# EAGLE schematic trailmon (EAGLE 7.5.0)

## Sheet 1 of 7
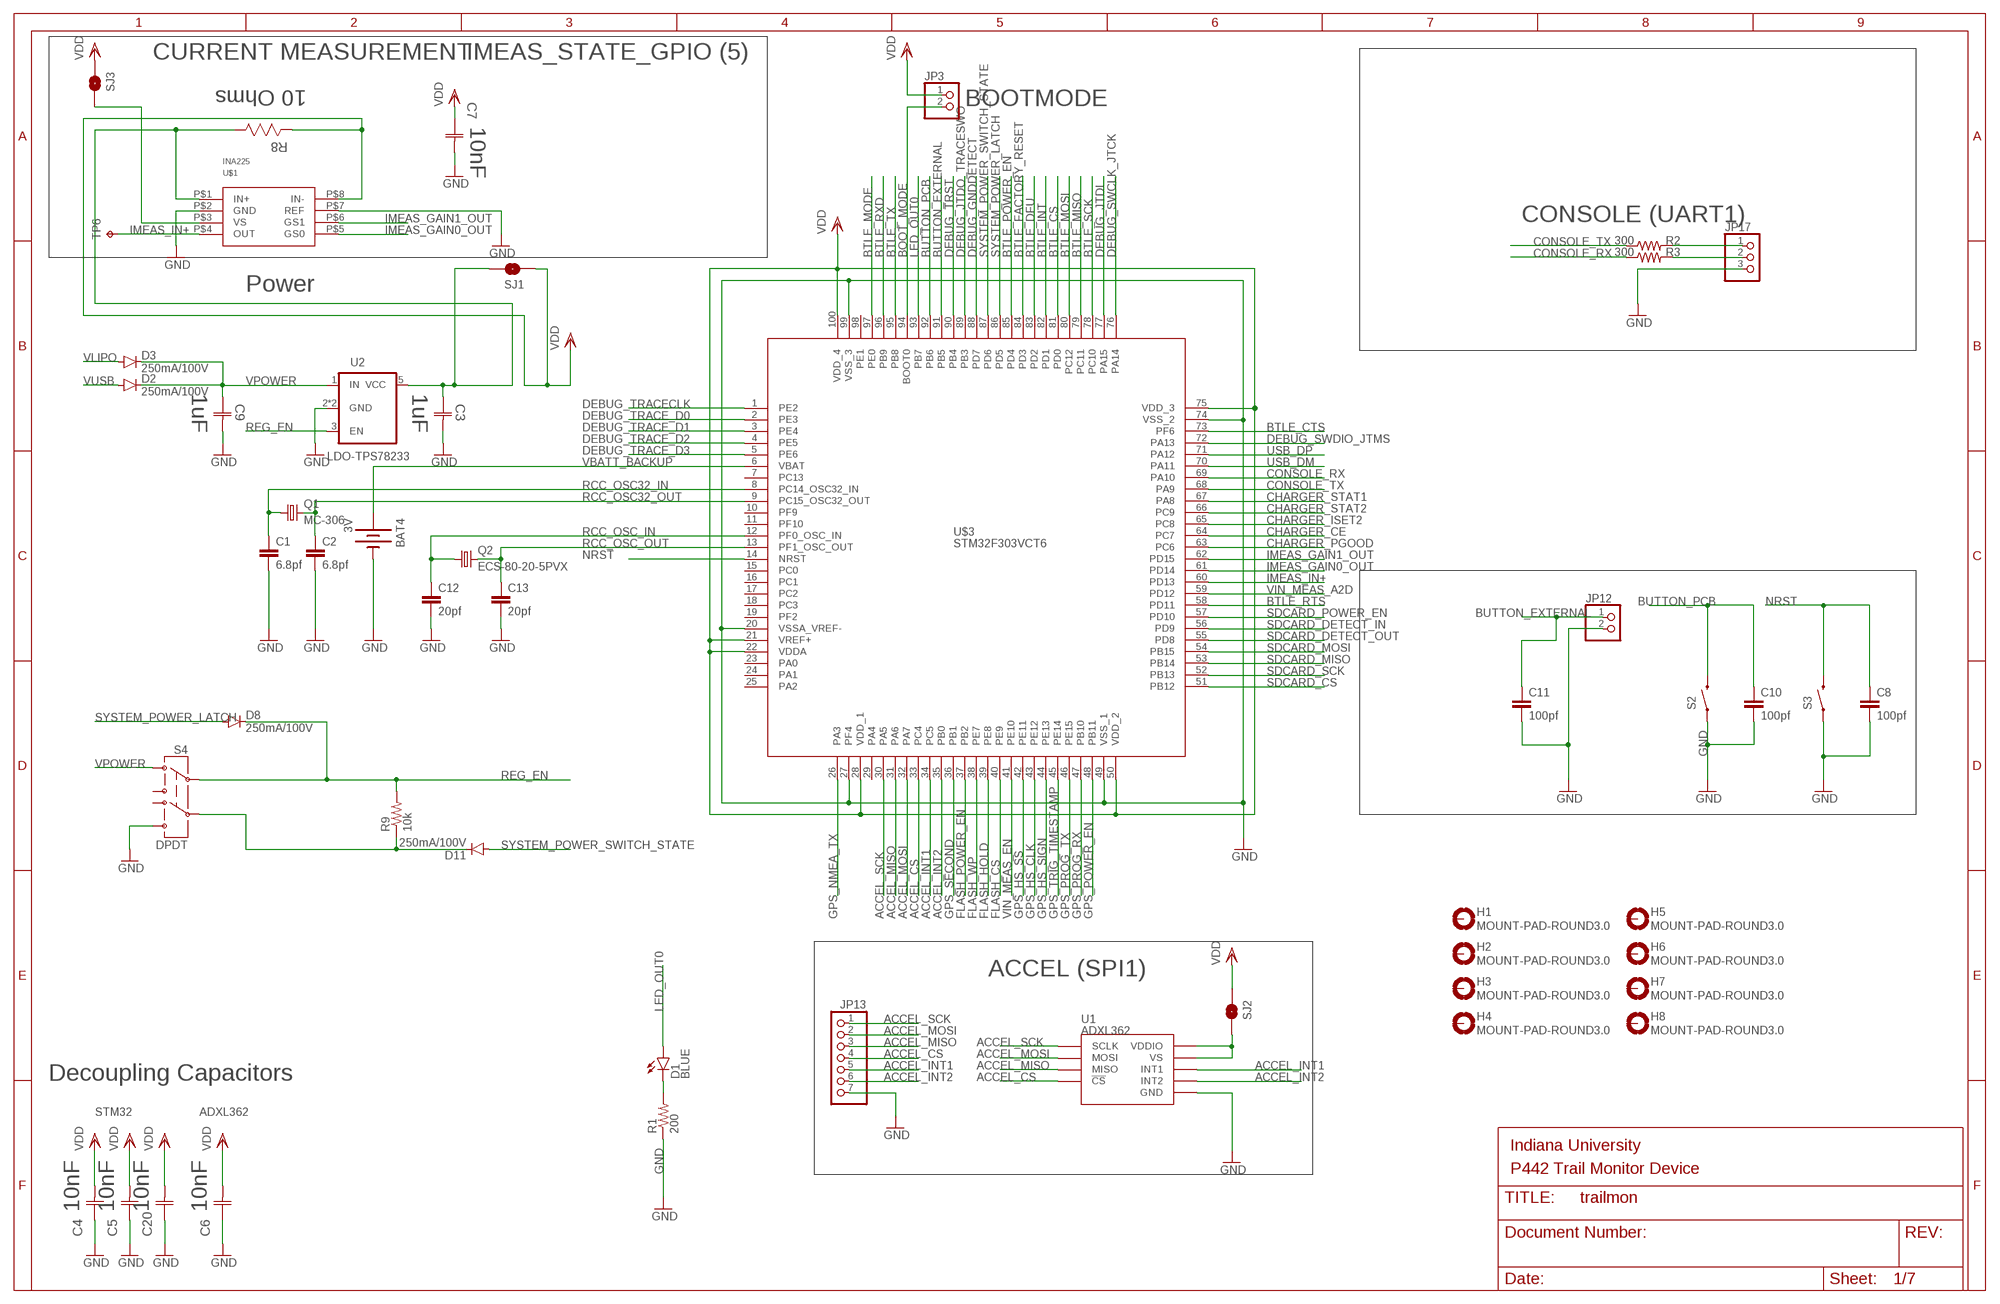
[diagram p0: schematic, sheet 1]

### Parts
BAT4  3V  BATTERY12MM  [BATTCON_12MM]
C1  6.8pf  CAP0603-CAP  [0603-CAP]
C2  6.8pf  CAP0603-CAP  [0603-CAP]
C3  1uF  C0805C105K4RACTU  [CAPC2013X110N]
C4  10nF  C0805C103K5RACTU  [CAPC2013X88N]
C5  10nF  C0805C103K5RACTU  [CAPC2013X88N]
C6  10nF  C0805C103K5RACTU  [CAPC2013X88N]
C7  10nF  C0805C103K5RACTU  [CAPC2013X88N]
C8  100pf  CAP0805  [0805]
C9  1uF  C0805C105K4RACTU  [CAPC2013X110N]
C10  100pf  CAP0805  [0805]
C11  100pf  CAP0805  [0805]
C12  20pf  CAP0603-CAP  [0603-CAP]
C13  20pf  CAP0603-CAP  [0603-CAP]
C20  10nF  C0805C103K5RACTU  [CAPC2013X88N]
D1  BLUE  LED-BLUE0603  [LED-0603]
D2  250mA/100V  DIODEBAS16  [SOD-323]
D3  250mA/100V  DIODEBAS16  [SOD-323]
D8  250mA/100V  DIODEBAS16  [SOD-323]
D11  250mA/100V  DIODEBAS16  [SOD-323]
H1  MOUNT-PAD-ROUND3.0  [3,0-PAD]
H2  MOUNT-PAD-ROUND3.0  [3,0-PAD]
H3  MOUNT-PAD-ROUND3.0  [3,0-PAD]
H4  MOUNT-PAD-ROUND3.0  [3,0-PAD]
H5  MOUNT-PAD-ROUND3.0  [3,0-PAD]
H6  MOUNT-PAD-ROUND3.0  [3,0-PAD]
H7  MOUNT-PAD-ROUND3.0  [3,0-PAD]
H8  MOUNT-PAD-ROUND3.0  [3,0-PAD]
JP3  PINHD-1X2  [1X02]
JP12  PINHD-1X2  [1X02]
JP13  PINHD-1X7  [1X07]
JP17  PINHD-1X3  [1X03]
Q1  MC-306  [MC-306]
Q2  ECS-80-20-5PVX  CSM-7X-DU  [CSM-7X-DU]
R1  200  RESISTOR0603-RES  [0603-RES]
R2  300  RESISTOR0805-RES  [0805]
R3  300  RESISTOR0805-RES  [0805]
R8  10 Ohms  TNPW060310R0BEEN  [RESC1608X60N]
R9  10k  RESISTOR0603-RES  [0603-RES]
S2  SWITCH-MOMENTARY-2SMD  [TACTILE-SWITCH-SMD]
S3  SWITCH-MOMENTARY-2SMD  [TACTILE-SWITCH-SMD]
S4  DPDT  SWITCH-DPDTAYZ0202  [AYZ0202]
SJ1  JUMPER-PAD-2-NOYES_SILK  [PAD-JUMPER-2-NO_YES_SILK]
SJ2  JUMPER-PAD-2-NOYES_SILK  [PAD-JUMPER-2-NO_YES_SILK]
SJ3  JUMPER-PAD-2-NOYES_SILK  [PAD-JUMPER-2-NO_YES_SILK]
TP6  TPB1,27  [B1,27]
U1  ADXL362  [ADXL362]
U2  LDO-TPS78233  [SOT23-5]
U$1  INA225  [MSOP-8]
U$3  STM32F303VCT6  [TQFP100]

### Nets
ACCEL_CS: JP13.4 U1.P$8(!CS) U$3.33(PC4)
ACCEL_INT1: JP13.5 U1.P$11(INT1) U$3.34(PC5)
ACCEL_INT2: JP13.6 U1.P$9(INT2) U$3.35(PB0)
ACCEL_MISO: JP13.3 U1.P$7(MISO) U$3.31(PA6)
ACCEL_MOSI: JP13.2 U1.P$6(MOSI) U$3.32(PA7)
ACCEL_SCK: JP13.1 U1.P$4(SCLK) U$3.30(PA5)
BOOT_MODE: JP3.2 U$3.94(BOOT0)
BTLE_CS: U$3.81(PD0) ; also sheet 7
BTLE_CTS: U$3.73(PF6) ; also sheet 7
BTLE_DFU: U$3.83(PD2) ; also sheet 7
BTLE_FACTORY_RESET: U$3.84(PD3) ; also sheet 7
BTLE_INT: U$3.82(PD1) ; also sheet 7
BTLE_MISO: U$3.79(PC11) ; also sheet 7
BTLE_MODE: U$3.97(PE0) ; also sheet 7
BTLE_MOSI: U$3.80(PC12) ; also sheet 7
BTLE_POWER_EN: U$3.85(PD4) ; also sheet 2
BTLE_RTS: U$3.58(PD11) ; also sheet 7
BTLE_RXD: U$3.96(PB9) ; also sheet 7
BTLE_SCK: U$3.78(PC10) ; also sheet 7
BTLE_TX: U$3.95(PB8) ; also sheet 7
BUTTON_EXTERNAL: C11.1 JP12.1 U$3.91(PB5)
BUTTON_PCB: C10.1 S2.3 U$3.92(PB6)
CHARGER_CE: U$3.64(PC7) ; also sheet 4
CHARGER_ISET2: U$3.65(PC8) ; also sheet 4
CHARGER_PGOOD: U$3.63(PC6) ; also sheet 4
CHARGER_STAT1: U$3.67(PA8) ; also sheet 4
CHARGER_STAT2: U$3.66(PC9) ; also sheet 4
CONSOLE_RX: R3.1 U$3.69(PA10)
CONSOLE_TX: R2.1 U$3.68(PA9)
DEBUG_GNDDETECT: U$3.88(PD7)
DEBUG_JTDI: U$3.77(PA15) ; also sheet 6
DEBUG_JTDO_TRACESWO: U$3.89(PB3) ; also sheet 6
DEBUG_SWCLK_JTCK: U$3.76(PA14) ; also sheet 6
DEBUG_SWDIO_JTMS: U$3.72(PA13) ; also sheet 6
DEBUG_TRACE_D0: U$3.2(PE3) ; also sheet 6
DEBUG_TRACE_D1: U$3.3(PE4) ; also sheet 6
DEBUG_TRACE_D2: U$3.4(PE5) ; also sheet 6
DEBUG_TRACE_D3: U$3.5(PE6) ; also sheet 6
DEBUG_TRACECLK: U$3.1(PE2) ; also sheet 6
DEBUG_TRST: U$3.90(PB4) ; also sheet 6
FLASH_CS: U$3.40(PE9) ; also sheet 5
FLASH_HOLD: U$3.39(PE8) ; also sheet 5
FLASH_POWER_EN: U$3.37(PB2) ; also sheet 2
FLASH_WP: U$3.38(PE7) ; also sheet 5
GND: BAT4.GND(-) C1.2 C2.2 C3.2(C2) C4.1(C1) C5.1(C1) C6.1(C1) C7.2(C2) C8.2 C9.2(C2) C10.2 C11.2 C12.2 C13.2 C20.1(C1) JP12.2 JP13.7 JP17.3 R1.1 S2.1 S3.1 S4.6 U1.P$12(GND) U1.P$13(GND) U1.P$16(GND) U2.2(GND) U2.4(GND) U$1.P$2(GND) U$1.P$7(REF) U$3.20(VSSA_VREF-) U$3.27(PF4) U$3.49(VSS_1) U$3.74(VSS_2) U$3.99(VSS_3) ; also sheet 2,3,4,5,6,7
GPS_HS_CLK: U$3.43(PE12) ; also sheet 3
GPS_HS_SIGN: U$3.44(PE13) ; also sheet 3
GPS_HS_SS: U$3.42(PE11) ; also sheet 3
GPS_NMEA_TX: U$3.26(PA3) ; also sheet 3
GPS_POWER_EN: U$3.48(PB11) ; also sheet 2
GPS_PROG_RX: U$3.47(PB10) ; also sheet 3
GPS_PROG_TX: U$3.46(PE15) ; also sheet 3
GPS_SECOND: U$3.36(PB1) ; also sheet 3
GPS_TRIG_TIMESTAMP: U$3.45(PE14) ; also sheet 3
IMEAS_GAIN0_OUT: U$1.P$5(GS0) U$3.61(PD14)
IMEAS_GAIN1_OUT: U$1.P$6(GS1) U$3.62(PD15)
IMEAS_IN+: TP6.TP U$1.P$4(OUT) U$3.60(PD13)
LED_OUT0: D1.A U$3.93(PB7)
N$4: D1.C R1.2
N$11: D11.C R9.1 S4.5
N$28: JP17.1 R2.2
N$29: JP17.2 R3.2
N$34: SJ2.2 U1.P$1(VDDIO) U1.P$14(VS)
N$35: SJ3.2 U$1.P$3(VS)
NRST: C8.1 S3.3 U$3.14(NRST) ; also sheet 6
RCC_OSC32_IN: C1.1 Q1.1 U$3.8(PC14_OSC32_IN)
RCC_OSC32_OUT: C2.1 Q1.4 U$3.9(PC15_OSC32_OUT)
RCC_OSC_IN: C12.1 Q2.1 U$3.12(PF0_OSC_IN)
RCC_OSC_OUT: C13.1 Q2.2 U$3.13(PF1_OSC_OUT)
REG_EN: D8.C R9.2 S4.2 U2.3(EN)
SDCARD_CS: U$3.51(PB12) ; also sheet 5
SDCARD_DETECT_IN: U$3.56(PD9) ; also sheet 5
SDCARD_DETECT_OUT: U$3.55(PD8) ; also sheet 5
SDCARD_MISO: U$3.53(PB14) ; also sheet 5
SDCARD_MOSI: U$3.54(PB15) ; also sheet 5
SDCARD_POWER_EN: U$3.57(PD10) ; also sheet 2
SDCARD_SCK: U$3.52(PB13) ; also sheet 5
SYSTEM_POWER_LATCH: D8.A U$3.86(PD5)
SYSTEM_POWER_SWITCH_STATE: D11.A U$3.87(PD6)
USB_DM: U$3.70(PA11) ; also sheet 4
USB_DP: U$3.71(PA12) ; also sheet 4
VBATT_BACKUP: BAT4.PWR@1(+) U$3.6(VBAT)
VCC: C3.1(C1) R8.1 SJ1.2 U2.5(VCC) U$1.P$1(IN+)
VDD: C4.2(C2) C5.2(C2) C6.2(C2) C7.1(C1) C20.2(C2) JP3.1 R8.2 SJ1.1 SJ2.1 SJ3.1 U$1.P$8(IN-) U$3.21(VREF+) U$3.22(VDDA) U$3.28(VDD_1) U$3.50(VDD_2) U$3.75(VDD_3) U$3.100(VDD_4) ; also sheet 2,4,6
VIN_MEAS_A2D: U$3.59(PD12) ; also sheet 2
VIN_MEAS_EN: U$3.41(PE10) ; also sheet 2
VLIPO: D3.A ; also sheet 2,4
VPOWER: C9.1(C1) D2.C D3.C S4.1 U2.1(IN)
VUSB: D2.A ; also sheet 4
Unconnected: H1.B3,0(MOUNT) H2.B3,0(MOUNT) H3.B3,0(MOUNT) H4.B3,0(MOUNT) H5.B3,0(MOUNT) H6.B3,0(MOUNT) H7.B3,0(MOUNT) H8.B3,0(MOUNT) S4.3 S4.4 U$3.7(PC13) U$3.10(PF9) U$3.11(PF10) U$3.15(PC0) U$3.16(PC1) U$3.17(PC2) U$3.18(PC3) U$3.19(PF2) U$3.23(PA0) U$3.24(PA1) U$3.25(PA2) U$3.29(PA4) U$3.98(PE1)

### Notes on the sheet
- CURRENT MEASUREMENT | IMEAS_STATE_GPIO (5)
- BOOTMODE
- CONSOLE (UART1)
- Power
- ACCEL (SPI1)
- Decoupling Capacitors
- STM32 | ADXL362
- Indiana University
- P442 Trail Monitor Device

## Sheet 2 of 7
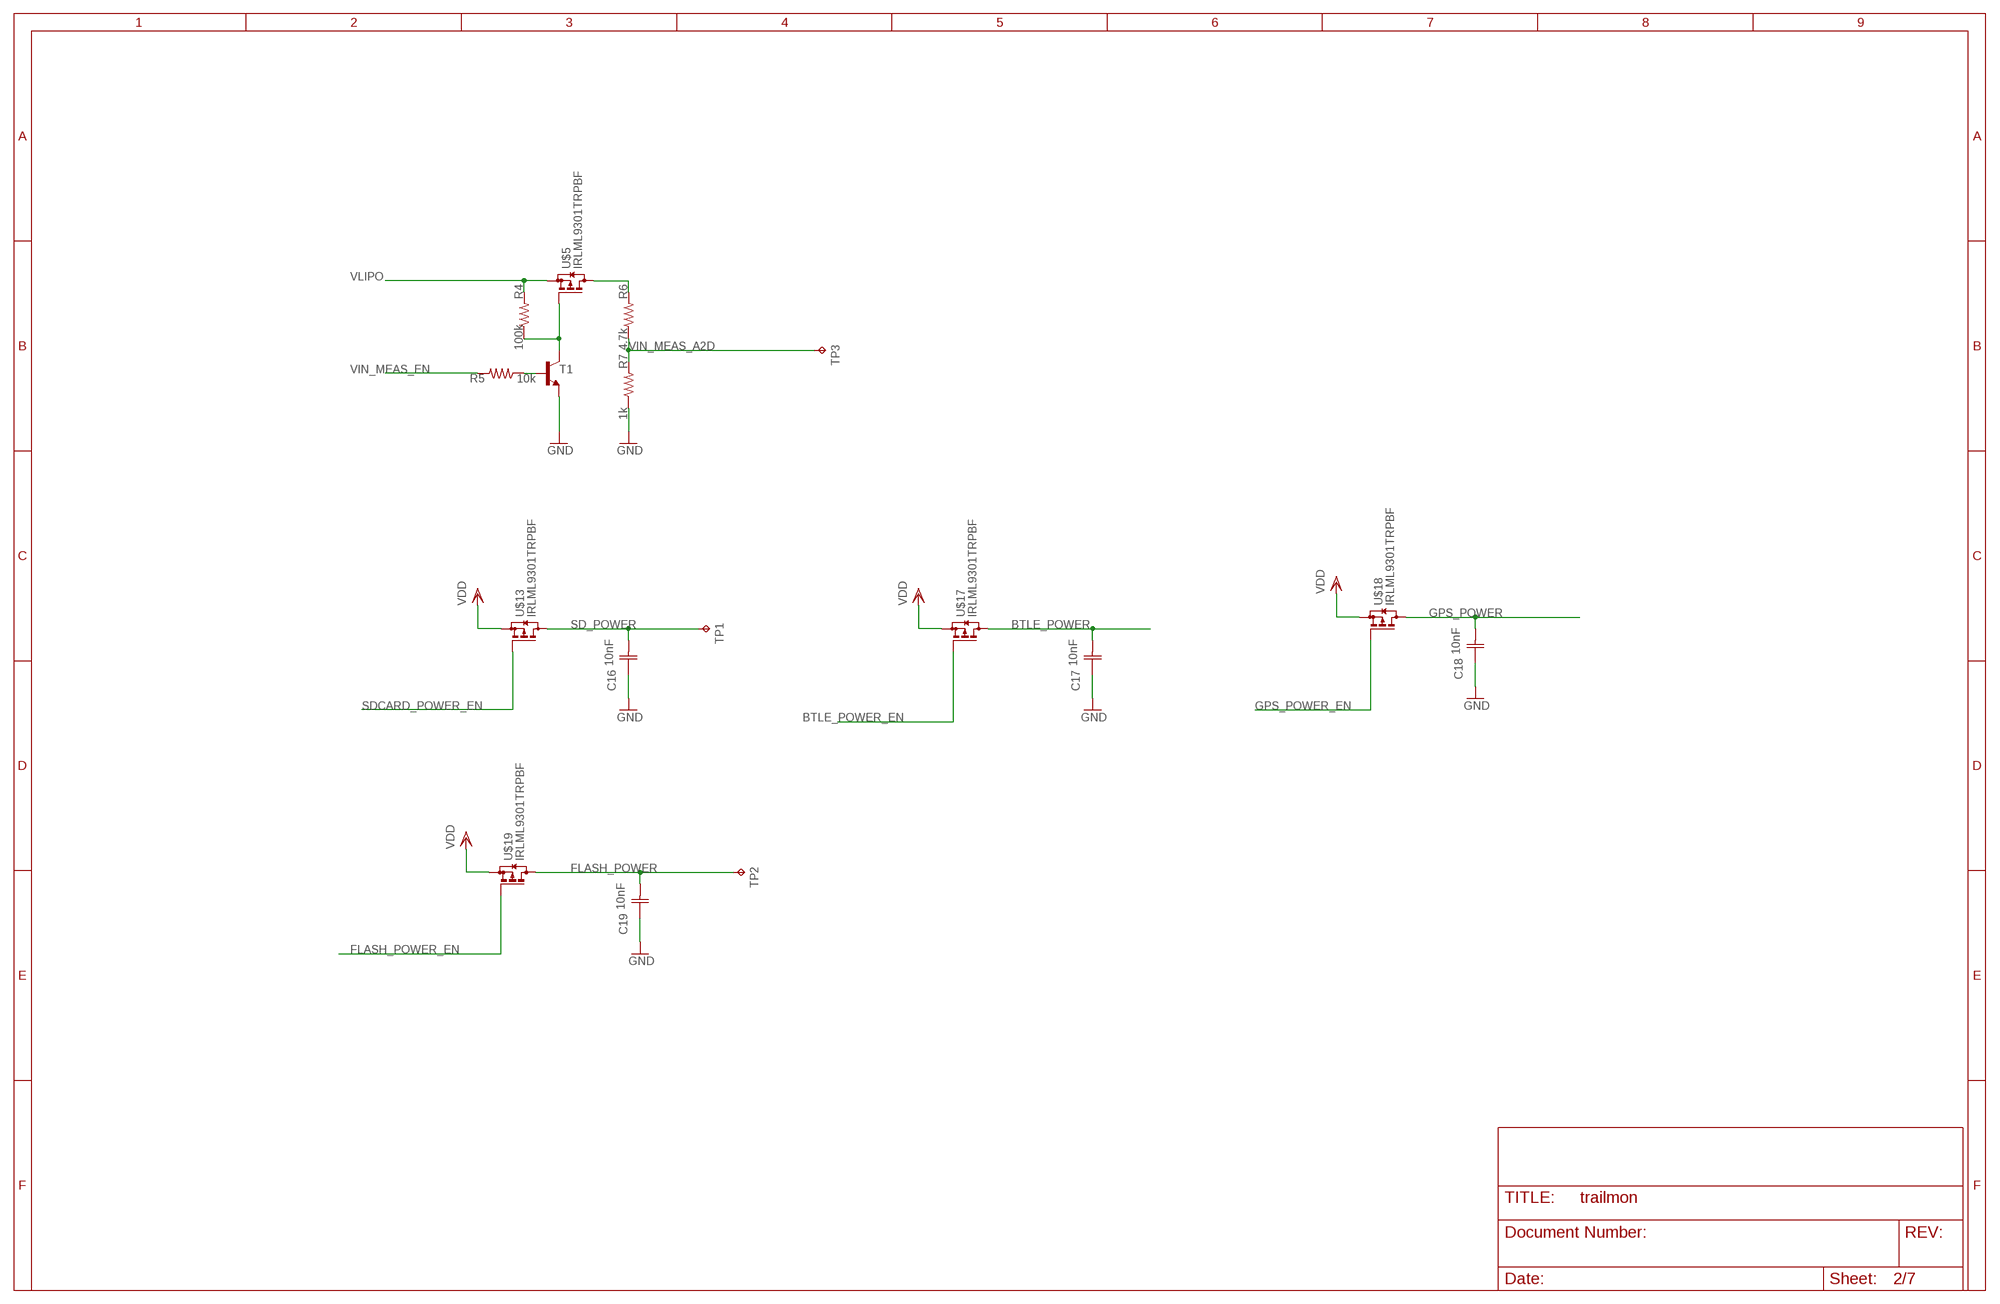
[diagram p1: schematic, sheet 2]

### Parts
C16  10nF  C0805C103K5RACTU  [CAPC2013X88N]
C17  10nF  C0805C103K5RACTU  [CAPC2013X88N]
C18  10nF  C0805C103K5RACTU  [CAPC2013X88N]
C19  10nF  C0805C103K5RACTU  [CAPC2013X88N]
R4  100k  RESISTOR0805-RES  [0805]
R5  10k  RESISTOR0805-RES  [0805]
R6  4.7k  RESISTOR0805-RES  [0805]
R7  1k  RESISTOR0805-RES  [0805]
T1  BC847  [SOT23]
TP1  TPB1,27  [B1,27]
TP2  TPB1,27  [B1,27]
TP3  TPB1,27  [B1,27]
U$5  IRLML9301TRPBF  [SOT23]
U$13  IRLML9301TRPBF  [SOT23]
U$17  IRLML9301TRPBF  [SOT23]
U$18  IRLML9301TRPBF  [SOT23]
U$19  IRLML9301TRPBF  [SOT23]

### Nets
BTLE_POWER: C17.2(C2) U$17.3(D) ; also sheet 7
BTLE_POWER_EN: U$17.1(G) ; also sheet 1
FLASH_POWER: C19.2(C2) TP2.TP U$19.3(D) ; also sheet 5
FLASH_POWER_EN: U$19.1(G) ; also sheet 1
GND: C16.1(C1) C17.1(C1) C18.1(C1) C19.1(C1) R7.1 T1.2(E) ; also sheet 1,3,4,5,6,7
GPS_POWER: C18.2(C2) U$18.3(D) ; also sheet 3
GPS_POWER_EN: U$18.1(G) ; also sheet 1
N$1: R5.1 T1.1(B)
N$5: R4.1 T1.3(C) U$5.1(G)
N$21: R6.2 U$5.3(D)
SD_POWER: C16.2(C2) TP1.TP U$13.3(D) ; also sheet 5
SDCARD_POWER_EN: U$13.1(G) ; also sheet 1
VDD: U$13.2(S) U$17.2(S) U$18.2(S) U$19.2(S) ; also sheet 1,4,6
VIN_MEAS_A2D: R6.1 R7.2 TP3.TP ; also sheet 1
VIN_MEAS_EN: R5.2 ; also sheet 1
VLIPO: R4.2 U$5.2(S) ; also sheet 1,4

## Sheet 3 of 7
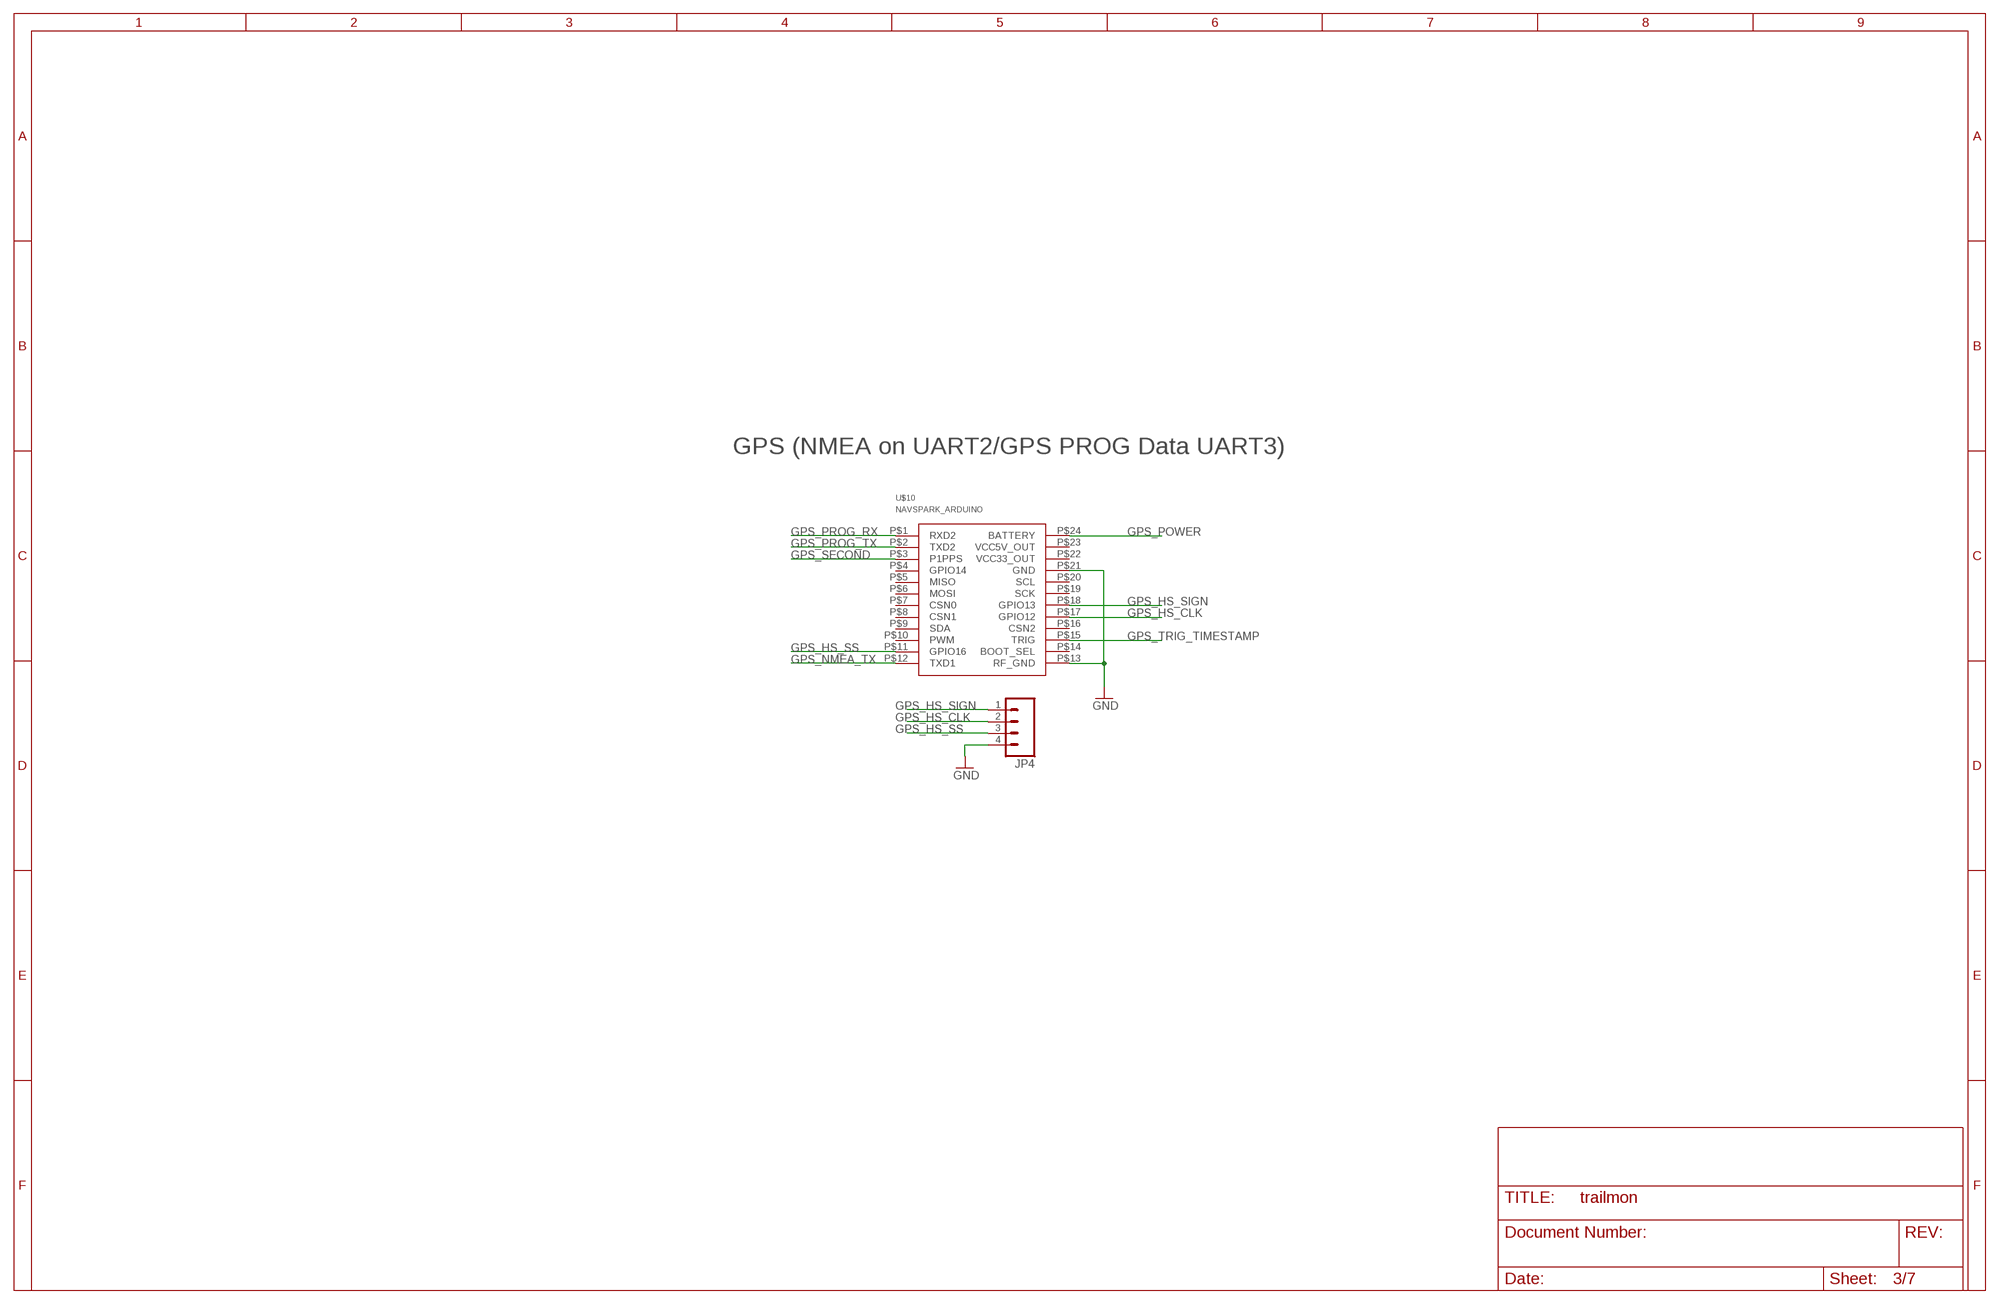
[diagram p2: schematic, sheet 3]

### Parts
JP4  M04PTH  [1X04]
U$10  NAVSPARK_ARDUINO  [NAVSPARK_ARDUINO]

### Nets
GND: JP4.4 U$10.P$13(RF_GND) U$10.P$21(GND) ; also sheet 1,2,4,5,6,7
GPS_HS_CLK: JP4.2 U$10.P$17(GPIO12) ; also sheet 1
GPS_HS_SIGN: JP4.1 U$10.P$18(GPIO13) ; also sheet 1
GPS_HS_SS: JP4.3 U$10.P$11(GPIO16) ; also sheet 1
GPS_NMEA_TX: U$10.P$12(TXD1) ; also sheet 1
GPS_POWER: U$10.P$24(BATTERY) ; also sheet 2
GPS_PROG_RX: U$10.P$1(RXD2) ; also sheet 1
GPS_PROG_TX: U$10.P$2(TXD2) ; also sheet 1
GPS_SECOND: U$10.P$3(P1PPS) ; also sheet 1
GPS_TRIG_TIMESTAMP: U$10.P$15(TRIG) ; also sheet 1
Unconnected: U$10.P$4(GPIO14) U$10.P$5(MISO) U$10.P$6(MOSI) U$10.P$7(CSN0) U$10.P$8(CSN1) U$10.P$9(SDA) U$10.P$10(PWM) U$10.P$14(BOOT_SEL) U$10.P$16(CSN2) U$10.P$19(SCK) U$10.P$20(SCL) U$10.P$22(VCC33_OUT) U$10.P$23(VCC5V_OUT)

### Notes on the sheet
- GPS (NMEA on UART2/GPS PROG Data UART3)

## Sheet 4 of 7
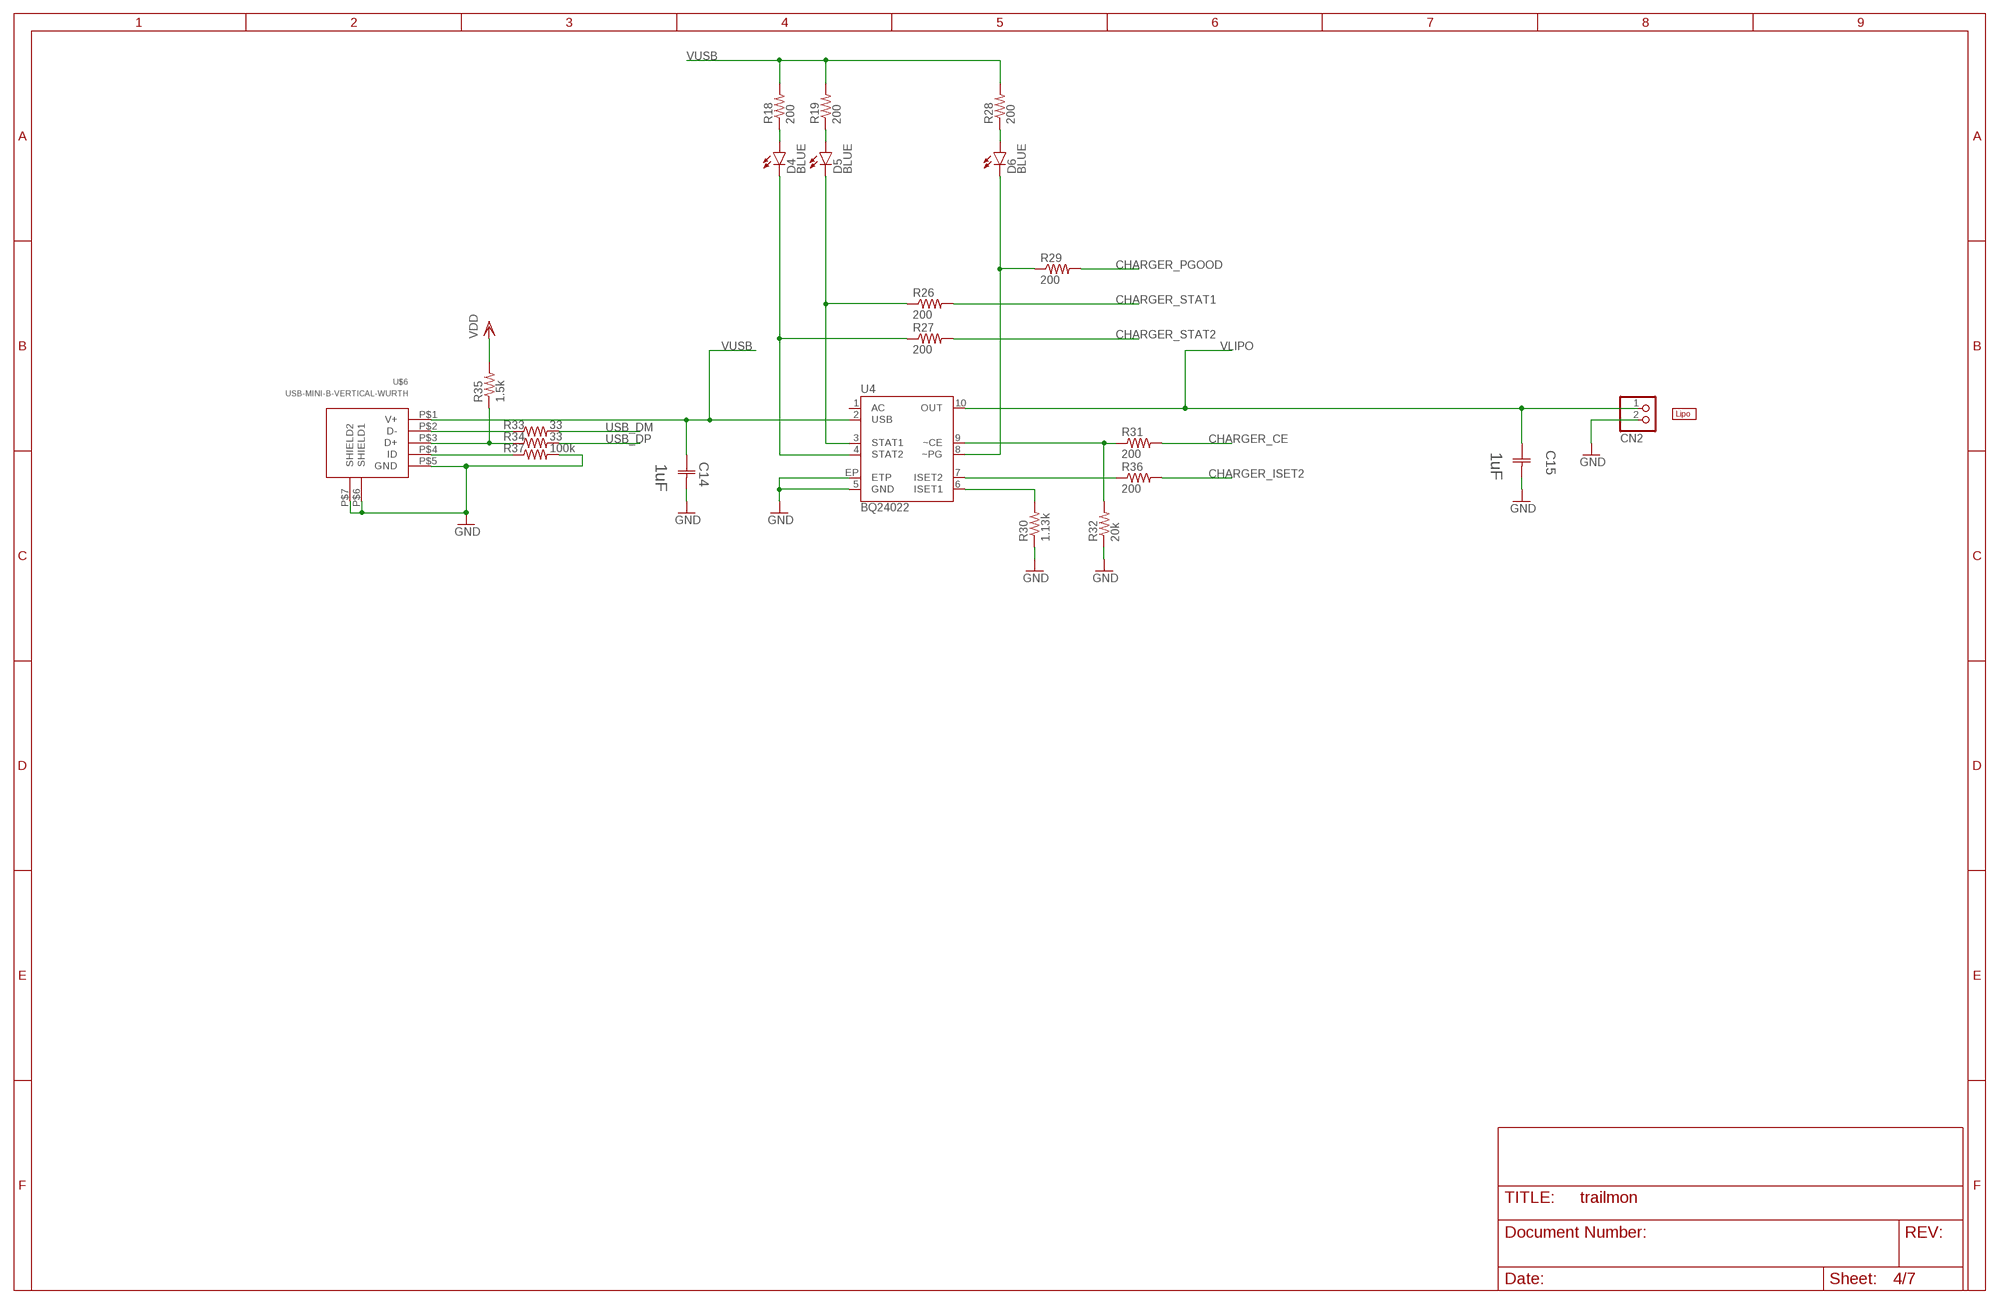
[diagram p3: schematic, sheet 4]

### Parts
C14  1uF  C0805C105K4RACTU  [CAPC2013X110N]
C15  1uF  C0805C105K4RACTU  [CAPC2013X110N]
CN2  JST_2PIN-THM  [JST-PH-2-THM]
D4  BLUE  LED-BLUE0603  [LED-0603]
D5  BLUE  LED-BLUE0603  [LED-0603]
D6  BLUE  LED-BLUE0603  [LED-0603]
R18  200  RESISTOR0603-RES  [0603-RES]
R19  200  RESISTOR0603-RES  [0603-RES]
R26  200  RESISTOR0603-RES  [0603-RES]
R27  200  RESISTOR0603-RES  [0603-RES]
R28  200  RESISTOR0603-RES  [0603-RES]
R29  200  RESISTOR0603-RES  [0603-RES]
R30  1.13k  RESISTOR0603-RES  [0603-RES]
R31  200  RESISTOR0603-RES  [0603-RES]
R32  20k  RESISTOR0603-RES  [0603-RES]
R33  33  RESISTOR0603-RES  [0603-RES]
R34  33  RESISTOR0603-RES  [0603-RES]
R35  1.5k  RESISTOR0603-RES  [0603-RES]
R36  200  RESISTOR0603-RES  [0603-RES]
R37  100k  RESISTOR0603-RES  [0603-RES]
U4  BQ24022  [DRC-10]
U$6  USB-MINI-B-VERTICAL-WURTH  [MINI-B-VERTICAL-WURTH]
U$16  LIPO-OUTLINE1100  [LIPO-1100]

### Nets
CHARGER_CE: R31.2 ; also sheet 1
CHARGER_ISET2: R36.2 ; also sheet 1
CHARGER_PGOOD: R29.2 ; also sheet 1
CHARGER_STAT1: R26.2 ; also sheet 1
CHARGER_STAT2: R27.2 ; also sheet 1
GND: C14.2(C2) C15.2(C2) CN2.2 R30.1 R32.1 R37.2 U4.5(GND) U4.EP(ETP) U$6.P$5(GND) U$6.P$6(SHIELD1) U$6.P$7(SHIELD2) ; also sheet 1,2,3,5,6,7
N$2: D4.C R27.1 U4.4(STAT2)
N$3: R33.1 U$6.P$2(D-)
N$20: D4.A R18.1
N$38: D5.C R26.1 U4.3(STAT1)
N$39: D5.A R19.1
N$42: D6.A R28.1
N$43: D6.C R29.1 U4.8(~PG)
N$45: R30.2 U4.6(ISET1)
N$46: R31.1 R32.2 U4.9(~CE)
N$48: R34.1 R35.1 U$6.P$3(D+)
N$49: R36.1 U4.7(ISET2)
N$51: R37.1 U$6.P$4(ID)
USB_DM: R33.2 ; also sheet 1
USB_DP: R34.2 ; also sheet 1
VDD: R35.2 ; also sheet 1,2,6
VLIPO: C15.1(C1) CN2.1 U4.10(OUT) ; also sheet 1,2
VUSB: C14.1(C1) R18.2 R19.2 R28.2 U4.2(USB) U$6.P$1(V+) ; also sheet 1
Unconnected: U4.1(AC)

## Sheet 5 of 7
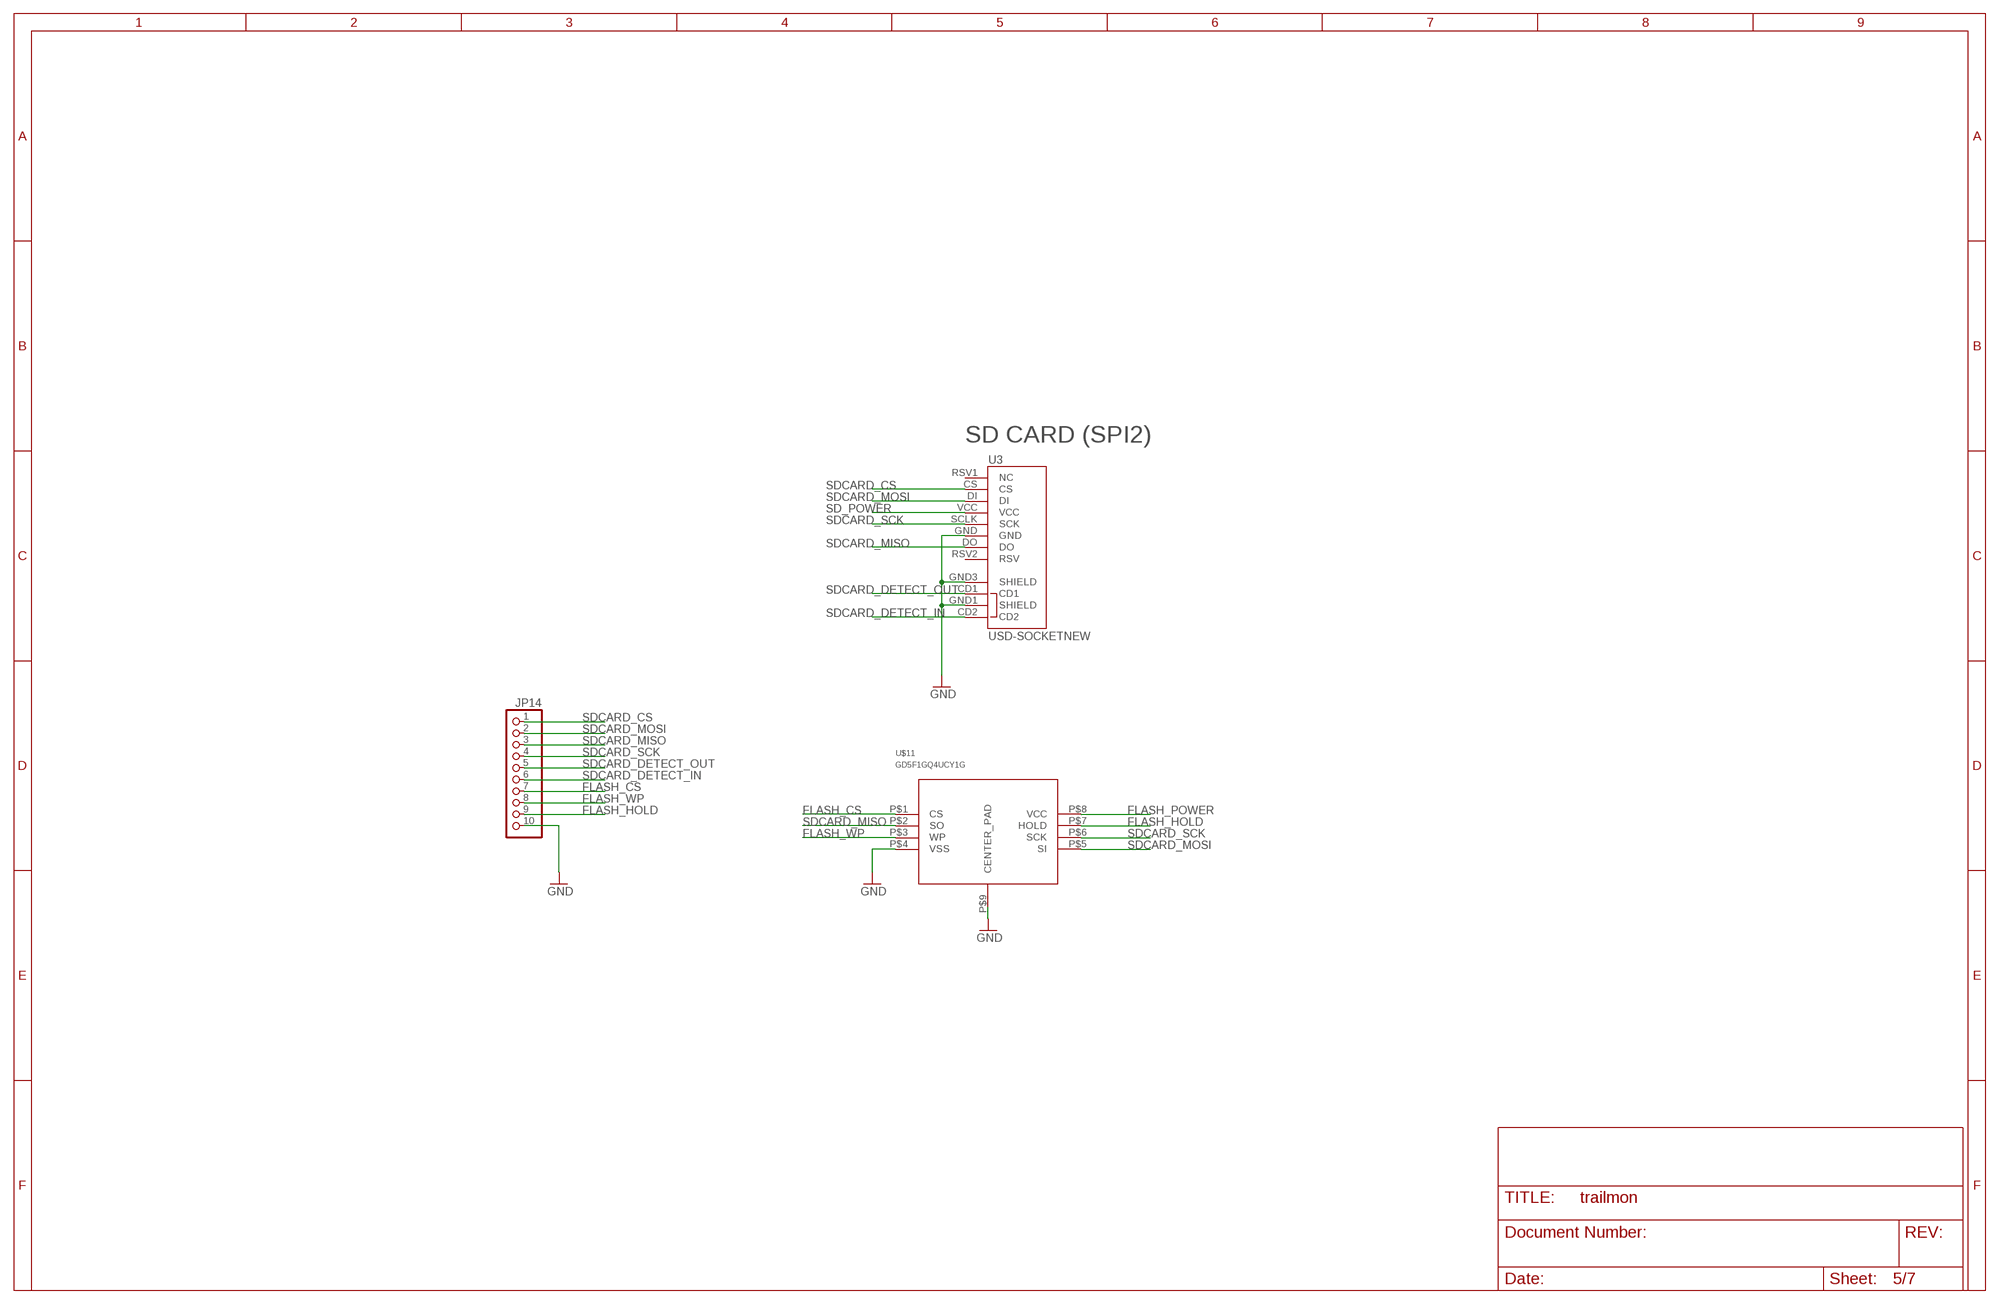
[diagram p4: schematic, sheet 5]

### Parts
JP14  PINHD-1X10  [1X10]
U3  USD-SOCKETNEW  [MICRO-SD-SOCKET-PP]
U$11  GD5F1GQ4UCY1G  [WSON-8]

### Nets
FLASH_CS: JP14.7 U$11.P$1(CS) ; also sheet 1
FLASH_HOLD: JP14.9 U$11.P$7(HOLD) ; also sheet 1
FLASH_POWER: U$11.P$8(VCC) ; also sheet 2
FLASH_WP: JP14.8 U$11.P$3(WP) ; also sheet 1
GND: JP14.10 U3.GND U3.GND1(SHIELD) U3.GND3(SHIELD) U$11.P$4(VSS) U$11.P$9(CENTER_PAD) ; also sheet 1,2,3,4,6,7
SD_POWER: U3.VCC ; also sheet 2
SDCARD_CS: JP14.1 U3.CS ; also sheet 1
SDCARD_DETECT_IN: JP14.6 U3.CD2 ; also sheet 1
SDCARD_DETECT_OUT: JP14.5 U3.CD1 ; also sheet 1
SDCARD_MISO: JP14.3 U3.DO U$11.P$2(SO) ; also sheet 1
SDCARD_MOSI: JP14.2 U3.DI U$11.P$5(SI) ; also sheet 1
SDCARD_SCK: JP14.4 U3.SCLK(SCK) U$11.P$6(SCK) ; also sheet 1
Unconnected: U3.RSV1(NC) U3.RSV2(RSV)

### Notes on the sheet
- SD CARD (SPI2)

## Sheet 6 of 7
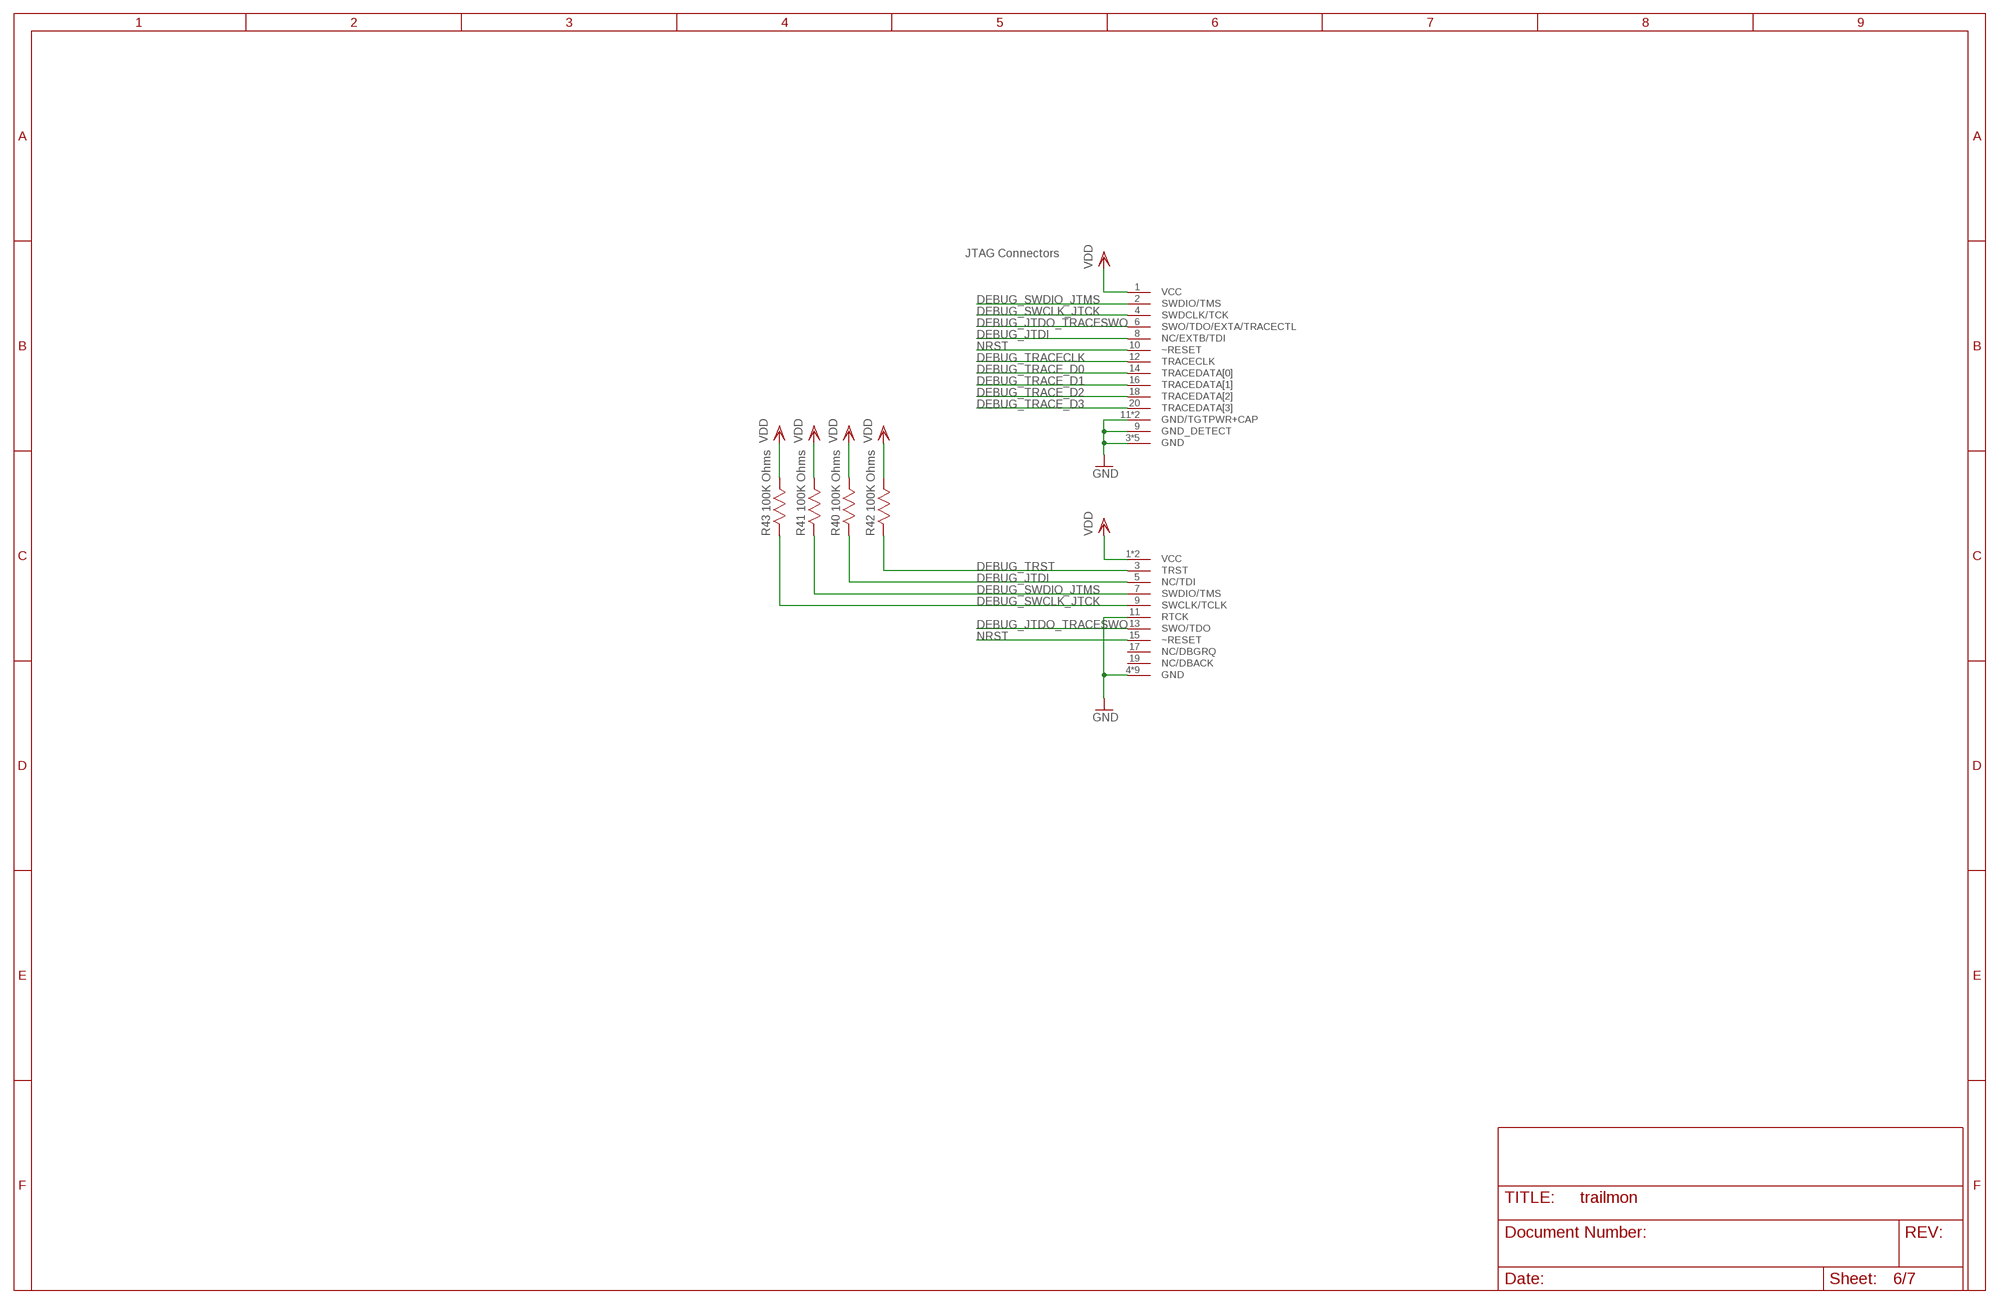
[diagram p5: schematic, sheet 6]

### Parts
R40  100K Ohms  CRCW0402100KFKED  [RESC1005X40N]
R41  100K Ohms  CRCW0402100KFKED  [RESC1005X40N]
R42  100K Ohms  CRCW0402100KFKED  [RESC1005X40N]
R43  100K Ohms  CRCW0402100KFKED  [RESC1005X40N]
U$2  2X10_0.05"_CORTEX_DEBUG_WITH_ETMSMD_UNSHROUDED  [2X10_0.05"_SMD_NS]
U$12  TRADITIONALJTAG/SWDTH_SHROUDED  [2X10_0.1"_TH_SH]

### Nets
DEBUG_JTDI: R40.2 U$2.8(NC/EXTB/TDI) U$12.5(NC/TDI) ; also sheet 1
DEBUG_JTDO_TRACESWO: U$2.6(SWO/TDO/EXTA/TRACECTL) U$12.13(SWO/TDO) ; also sheet 1
DEBUG_SWCLK_JTCK: R43.2 U$2.4(SWDCLK/TCK) U$12.9(SWCLK/TCLK) ; also sheet 1
DEBUG_SWDIO_JTMS: R41.2 U$2.2(SWDIO/TMS) U$12.7(SWDIO/TMS) ; also sheet 1
DEBUG_TRACE_D0: U$2.14(TRACEDATA[0]) ; also sheet 1
DEBUG_TRACE_D1: U$2.16(TRACEDATA[1]) ; also sheet 1
DEBUG_TRACE_D2: U$2.18(TRACEDATA[2]) ; also sheet 1
DEBUG_TRACE_D3: U$2.20(TRACEDATA[3]) ; also sheet 1
DEBUG_TRACECLK: U$2.12(TRACECLK) ; also sheet 1
DEBUG_TRST: R42.2 U$12.3(TRST) ; also sheet 1
GND: U$2.3(GND) U$2.5(GND) U$2.9(GND_DETECT) U$2.11(GND/TGTPWR+CAP) U$2.13(GND/TGTPWR+CAP) U$2.15(GND) U$2.17(GND) U$2.19(GND) U$12.4(GND) U$12.6(GND) U$12.8(GND) U$12.10(GND) U$12.11(RTCK) U$12.12(GND) U$12.14(GND) U$12.16(GND) U$12.18(GND) U$12.20(GND) ; also sheet 1,2,3,4,5,7
NRST: U$2.10(~RESET) U$12.15(~RESET) ; also sheet 1
VDD: R40.1 R41.1 R42.1 R43.1 U$2.1(VCC) U$12.1(VCC) U$12.2(VCC) ; also sheet 1,2,4
Unconnected: U$12.17(NC/DBGRQ) U$12.19(NC/DBACK)

### Notes on the sheet
- JTAG Connectors

## Sheet 7 of 7
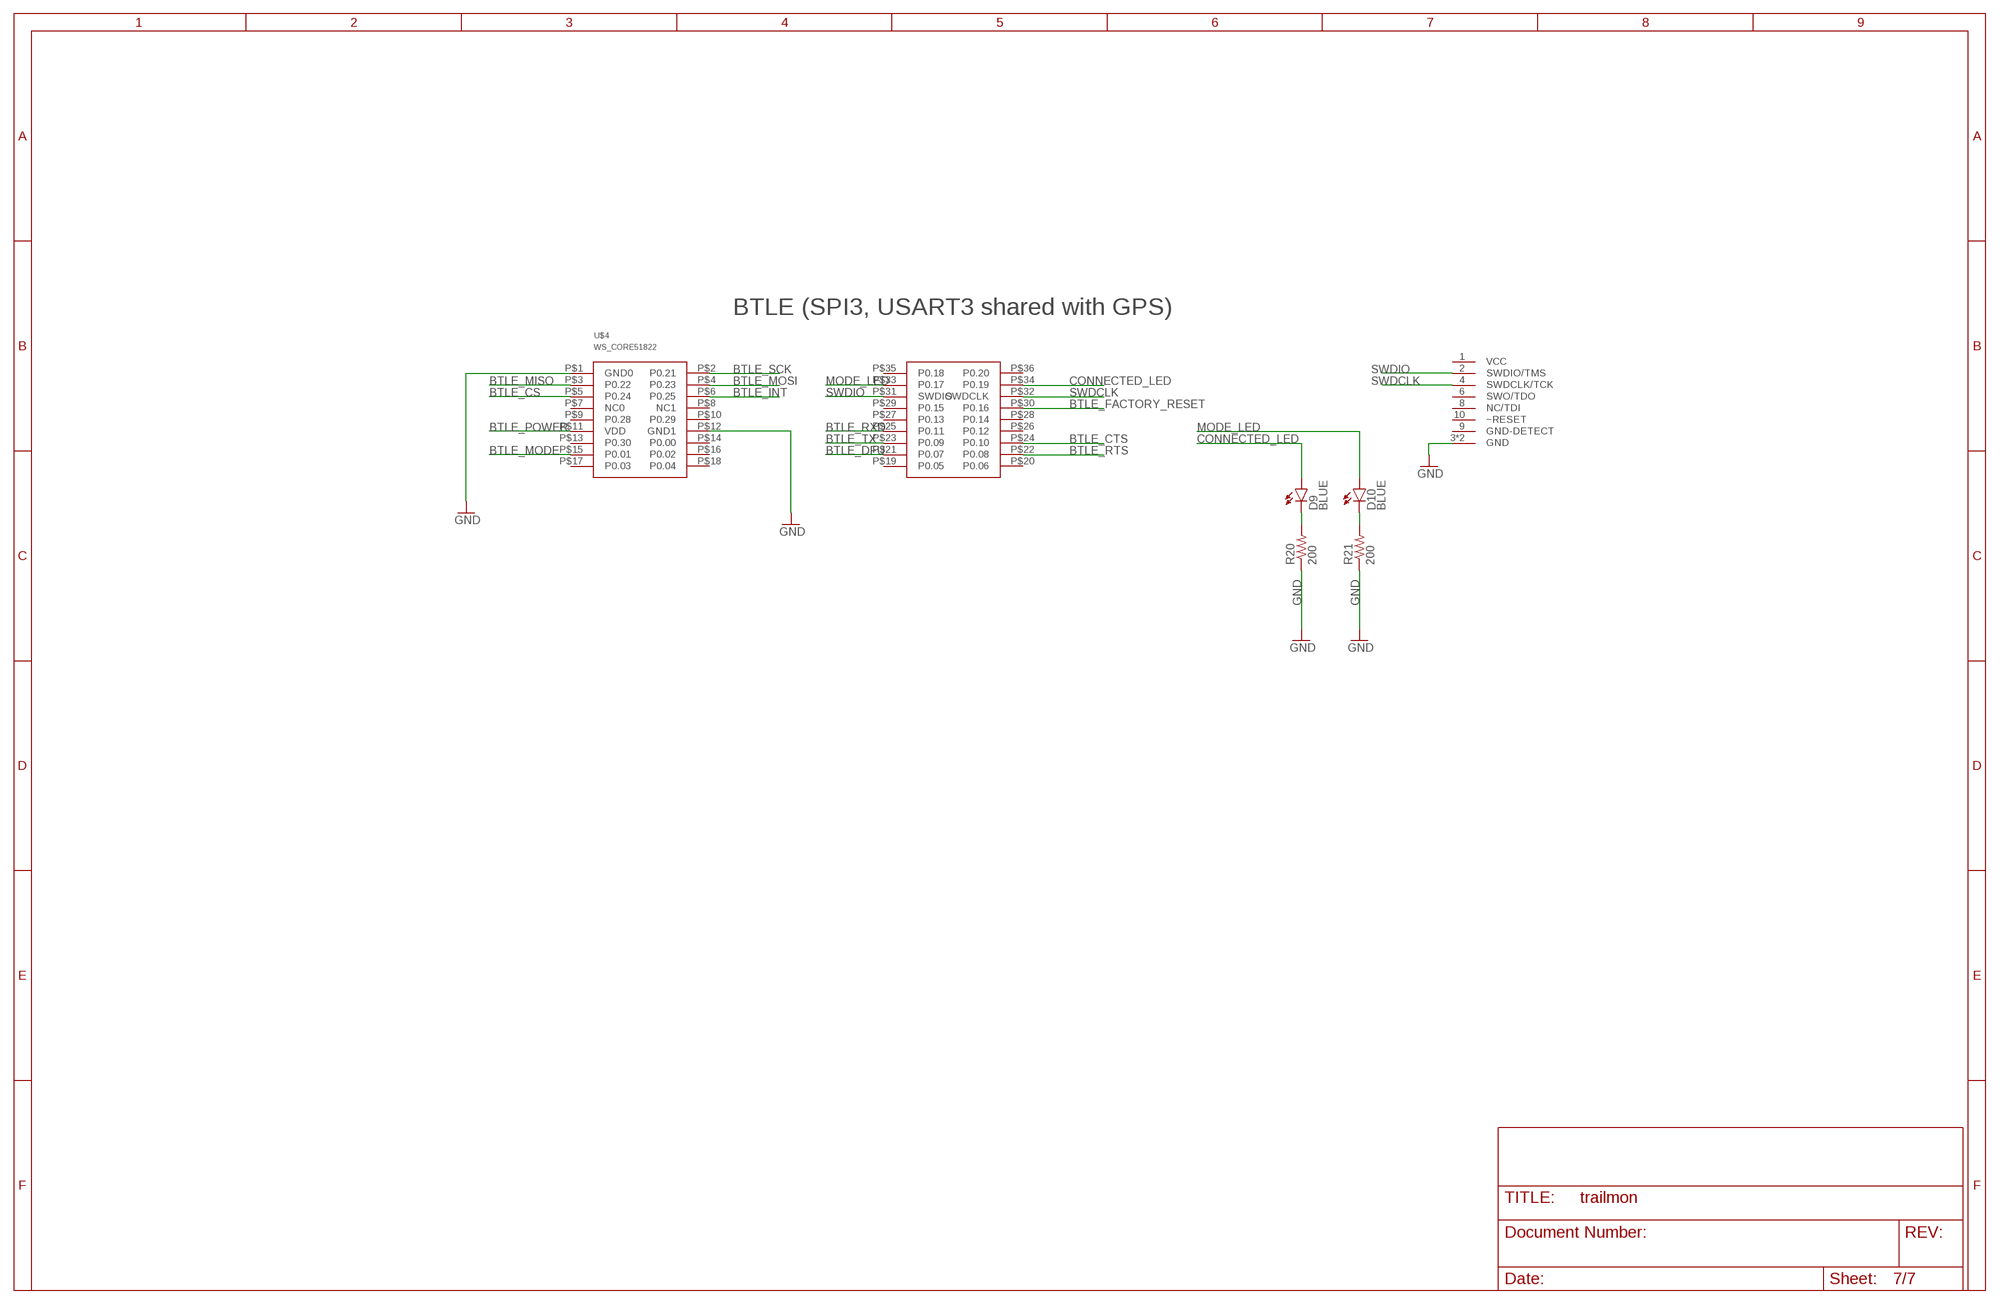
[diagram p6: schematic, sheet 7]

### Parts
D9  BLUE  LED-BLUE0603  [LED-0603]
D10  BLUE  LED-BLUE0603  [LED-0603]
R20  200  RESISTOR0603-RES  [0603-RES]
R21  200  RESISTOR0603-RES  [0603-RES]
U$4  WS_CORE51822  [WS_CORE51822]
U$15  2X5_0.05"_CORTEX_DEBUGTH_NOKEY_UNSHROUDED  [2X5_0.05"_TH_NS]

### Nets
BTLE_CS: U$4.P$5(P0.24) ; also sheet 1
BTLE_CTS: U$4.P$24(P0.10) ; also sheet 1
BTLE_DFU: U$4.P$21(P0.07) ; also sheet 1
BTLE_FACTORY_RESET: U$4.P$30(P0.16) ; also sheet 1
BTLE_INT: U$4.P$6(P0.25) ; also sheet 1
BTLE_MISO: U$4.P$3(P0.22) ; also sheet 1
BTLE_MODE: U$4.P$15(P0.01) ; also sheet 1
BTLE_MOSI: U$4.P$4(P0.23) ; also sheet 1
BTLE_POWER: U$4.P$11(VDD) ; also sheet 2
BTLE_RTS: U$4.P$22(P0.08) ; also sheet 1
BTLE_RXD: U$4.P$25(P0.11) ; also sheet 1
BTLE_SCK: U$4.P$2(P0.21) ; also sheet 1
BTLE_TX: U$4.P$23(P0.09) ; also sheet 1
CONNECTED_LED: D9.A U$4.P$34(P0.19)
GND: R20.1 R21.1 U$4.P$1(GND0) U$4.P$12(GND1) U$15.3(GND) U$15.5(GND) ; also sheet 1,2,3,4,5,6
MODE_LED: D10.A U$4.P$33(P0.17)
N$12: D9.C R20.2
N$27: D10.C R21.2
SWDCLK: U$4.P$32(SWDCLK) U$15.4(SWDCLK/TCK)
SWDIO: U$4.P$31(SWDIO) U$15.2(SWDIO/TMS)
Unconnected: U$4.P$7(NC0) U$4.P$8(NC1) U$4.P$9(P0.28) U$4.P$10(P0.29) U$4.P$13(P0.30) U$4.P$14(P0.00) U$4.P$16(P0.02) U$4.P$17(P0.03) U$4.P$18(P0.04) U$4.P$19(P0.05) U$4.P$20(P0.06) U$4.P$26(P0.12) U$4.P$27(P0.13) U$4.P$28(P0.14) U$4.P$29(P0.15) U$4.P$35(P0.18) U$4.P$36(P0.20) U$15.1(VCC) U$15.6(SWO/TDO) U$15.8(NC/TDI) U$15.9(GND-DETECT) U$15.10(~RESET)

### Notes on the sheet
- BTLE (SPI3, USART3 shared with GPS)

## Library data of the parts
BAT4 = SparkFun-Electromechanical:BATTERY: Battery Holders Various common sizes : AA, AAA, 18650 (PRT-12895), 20mm coin cell and 12mm coin cell. 20MM_4LEGS, BATT-10373; PROD_ID: BATT-08044
C1 C2 C8 C10-C13 = SparkFun-Passives:CAP: Capacitor Standard 0603 ceramic capacitor, and 0.1" leaded capacitor.
C3 C9 C14 C15 = Kemet_By_element14_Batch_1:C0805C105K4RACTU: CAPACITOR, 0805; MPN: C0805C105K4RACTU; OC_FARNELL: 9227792; OC_NEWARK: 77C5351; SUPPLIER: Kemet; TOLERANCE: ±10%; VOLTAGERATING: 16V
C4-C7 C16-C20 = Kemet_By_element14_Batch_1:C0805C103K5RACTU: CAPACITOR, 0805; MPN: C0805C103K5RACTU; OC_FARNELL: 1414662; OC_NEWARK: 01J3314; SUPPLIER: Kemet; TOLERANCE: ±10%; VOLTAGERATING: 50V
CN2 = adafruit:JST_2PIN: JST 2-Pin Connectors of various flavors SMT-RA (S2B-PH-SM4) 4UConnector #17311 SMT (B2B-PH-SM4) THM-RA (S2B-PH) THM (B2B-PH)
D1 D4-D6 D9 D10 = SparkFun-LED:LED-BLUE: Blue LEDs for production use Various blue LEDs stocked by SparkFun production 0603 - DIO-08575 Rebel - DIO-09553 1206 - DIO-09911; PROD_ID: DIO-08575
D2 D3 D8 D11 = SparkFun-DiscreteSemi:DIODE: Diode These are standard reverse protection diodes and small signal diodes. SMA package can handle up to about 1A. SOD-323 can handle about 200mA. What the SOD-323 package when ordering, there are some mfgs out there that are 5-pin packages.; PROD_ID: DIO-09646
H1-H8 = holes:MOUNT-PAD-ROUND: MOUNTING PAD, round
JP3 JP12 = pinhead:PINHD-1X2: PIN HEADER
JP4 = SparkFun-Connectors:M04: Header 4 Standard 4-pin 0.1" header. Use with straight break away headers (SKU : PRT-00116), right angle break away headers (PRT-00553), swiss pins (PRT-00743), machine pins (PRT-00117), and female headers (PRT-00115). Molex polarized connector foot print use with SKU : PRT-08231 with associated crimp pins and housings. 1MM SMD Version SKU: PRT-10208; PROD_ID: CONN-09696
JP13 = pinhead:PINHD-1X7: PIN HEADER
JP14 = pinhead:PINHD-1X10: PIN HEADER
JP17 = pinhead:PINHD-1X3: PIN HEADER
Q1 = crystal:MC-306: kHz RANGE CRYSTAL UNIT SMD Source: MC-306_405_406_E07X.PDF Homepage <http://www.epsontoyocom.co.jp>; MPN: MC-306 60.0KHZ 100PPM ,12.5PF; OC_FARNELL: 1278040; OC_NEWARK: 31M5576
Q2 = crystal:CSM-7X-DU: SMD CRYSTAL Source: www.ecsxtal.com .. Crystal 3.6864MHz CSM_7X_DU.PDF; OC_FARNELL: unknown; OC_NEWARK: unknown
R1-R7 R9 R18-R21 R26-R37 = SparkFun-Passives:RESISTOR: Resistor Basic schematic elements and footprints for 0603, 1206, and PTH resistors.
R8 = Vishay_By_element14_Batch_1:TNPW060310R0BEEN: RESISTOR, 0603; MPN: TNPW060310R0BEEN; OC_FARNELL: 1553930; OC_NEWARK: 71M1229; SUPPLIER: Vishay; TOLERANCE: ± 0.1 %; WATTAGE: 0.1 W
R40-R43 = Vishay_By_element14_Batch_1:CRCW0402100KFKED: RESISTOR, 0402; MPN: CRCW0402100KFKED; OC_FARNELL: 1469671; OC_NEWARK: -; SUPPLIER: Vishay; TOLERANCE: ±1%; WATTAGE: 0.063W
S2 S3 = SparkFun-Electromechanical:SWITCH-MOMENTARY-2: Various NO switches- pushbuttons, reed, etc; PROD_ID: SWCH-08247
S4 = SparkFun-Electromechanical:SWITCH-DPDT: DPDT Version of the COM-00597; PROD_ID: SWCH-08179
SJ1-SJ3 = SparkFun-Passives:JUMPER-PAD-2-NO
T1 = transistor:BC847: NPN TRANSISTOR
TP1-TP3 TP6 = testpad:TP: Test pad
U1 = SparkFun-Sensors:ADXL362: Micropower 3-axis accelerometer 2/4/8g digital output (SPI) IC-11297; PROD_ID: IC-11297
U2 = SparkFun-PowerIC:LDO-TPS78233: Voltage Regulator LDO 500nA Ground Current, 150mA, Ultra-Low Quiescent Current Low-Dropout Linear Regulator.
U3 = SparkFun-Connectors:USD-SOCKET: microSD Socket Push-push type uSD socket. Schematic element and footprint production proven. Spark Fun Electronics SKU : PRT-00127. tDoc lines correctly indicate media card edge positions when inserting (unlocked, locked, depressed). NOTE: CD1 and CD2 are connected internally; PROD_ID: CONN-07820
U4 = SparkFun-PowerIC:BQ24022: Single-chip, Li-ion and Li-pol charger IC with autonomous USB-port and AC-adapter supply management. Datasheet: http://focus.ti.com/lit/ds/symlink/bq24022.pdf Unproven Last modified: 8/16/10
U$1 = ina:INA225
U$2 = con-cortex:2X10_0.05"_CORTEX_DEBUG_WITH_ETM
U$3 = stmf3:STM32F303VCT6: STM32 F303VCT6 in 100 pin TQFP package
U$4 = bluetooth:WS_CORE51822
U$5 U$13 U$17-U$19 = trans:IRLML9301TRPBF
U$6 = usb:USB-MINI-B-VERTICAL-WURTH
U$10 = gps:NAVSPARK_ARDUINO
U$11 = memory:GD5F1GQ4UCY1G
U$12 = con-cortex:TRADITIONALJTAG/SWD
U$15 = con-cortex:2X5_0.05"_CORTEX_DEBUG
U$16 = SparkFun-Electromechanical:LIPO-OUTLINE: Outlines for common LiPo batteries sold by SparkFun. For fit only- no pads or connectors!